# Altium schematic sheet PMIC.SchDoc
size A4; SheetNumber: 3; SheetTotal: 10
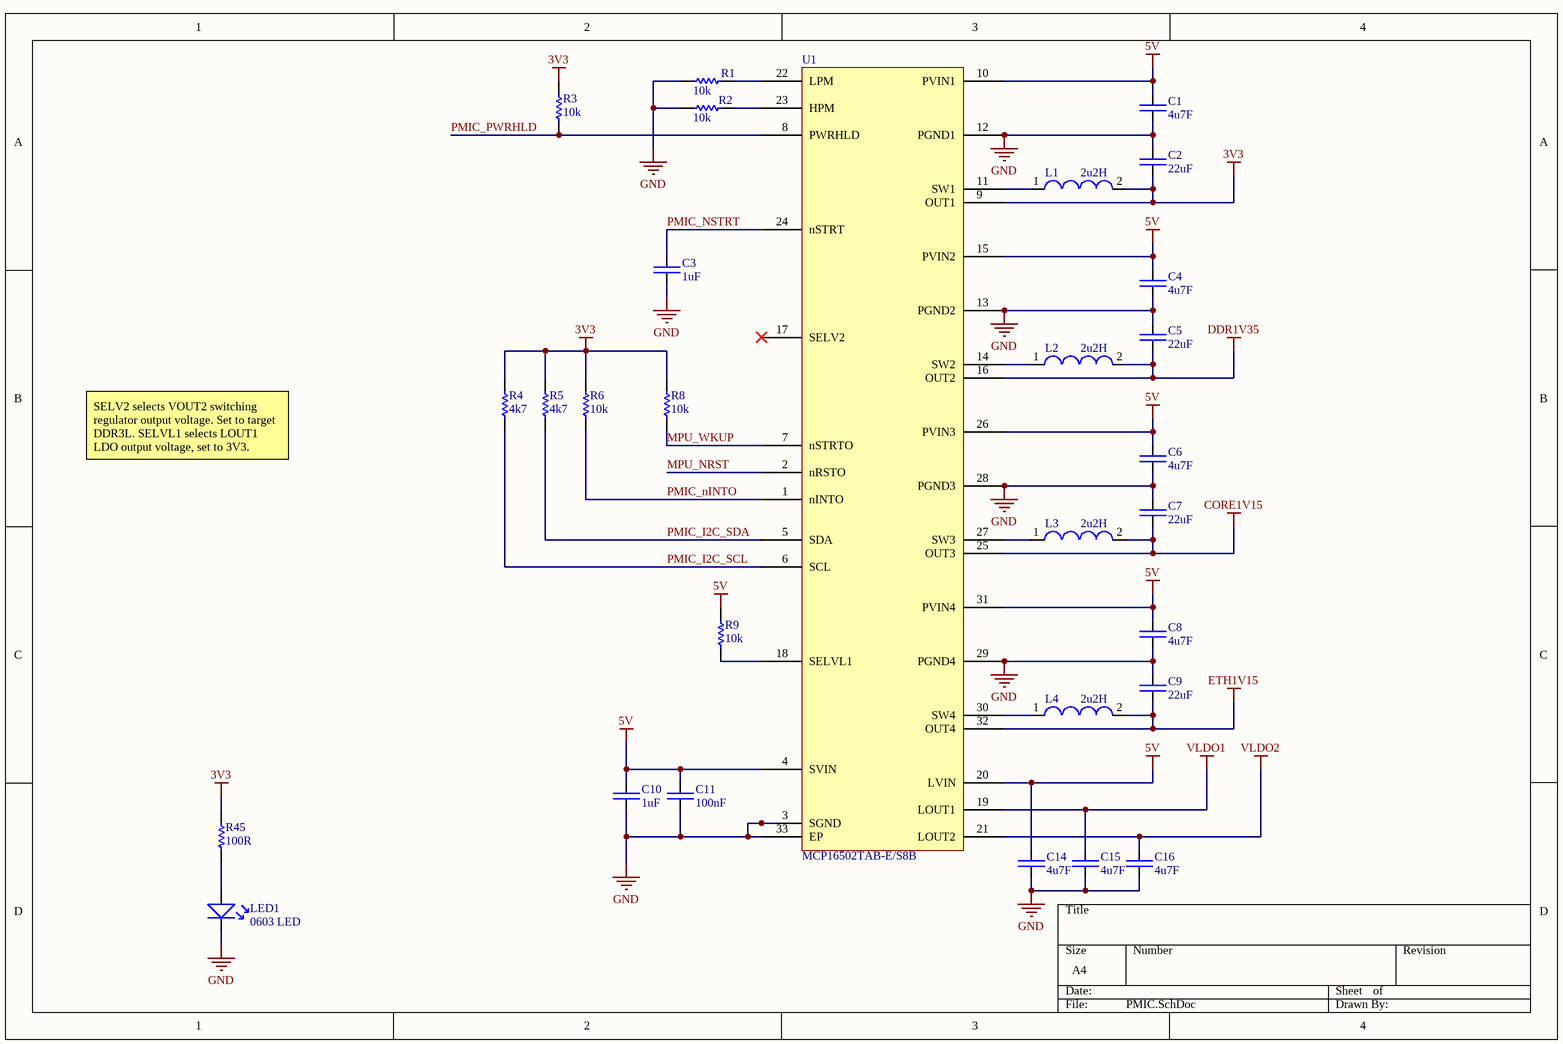
[diagram p0: PMIC.SchDoc]

## Parts
C1  4u7F  [CAP-0805]
C2  22uF  [CAP-1206]
C3  1uF  [CAP-0805]
C4  4u7F  [CAP-0805]
C5  22uF  [CAP-1206]
C6  4u7F  [CAP-0805]
C7  22uF  [CAP-1206]
C8  4u7F  [CAP-0805]
C9  22uF  [CAP-1206]
C10  1uF  [CAP-0805]
C11  100nF  [CAP-0603]
C14  4u7F  [CAP-0805]
C15  4u7F  [CAP-0805]
C16  4u7F  [CAP-0805]
L1  2u2H  [IND-1210]
L2  2u2H  [IND-1210]
L3  2u2H  [IND-1210]
L4  2u2H  [IND-1210]
LED1  0603 LED  [0603 LED]
R1  10k  [RES-0603]
R2  10k  [RES-0603]
R3  10k  [RES-0603]
R4  4k7  [RES-0603]
R5  4k7  [RES-0603]
R6  10k  [RES-0603]
R8  10k  [RES-0603]
R9  10k  [RES-0603]
R45  100R  [RES-0603]
U1  MCP16502TAB-E/S8B  [MCP16502TAB-E/S8B]

## Nets
3V3: C2.1 L1.2 R3.1 R4.2 R5.2 R6.2 R8.2 R45.2 U1.9(OUT1)
5V: C1.2 C4.2 C6.2 C8.2 C10.2 C11.2 C14.2 R9.2 U1.4(SVIN) U1.10(PVIN1) U1.15(PVIN2) U1.20(LVIN) U1.26(PVIN3) U1.31(PVIN4)
CORE1V15: C7.1 L3.2 U1.25(OUT3)
DDR1V35: C5.1 L2.2 U1.16(OUT2)
ETH1V15: C9.1 L4.2 U1.32(OUT4)
GND: C1.1 C2.2 C3.1 C4.1 C5.2 C6.1 C7.2 C8.1 C9.2 C10.1 C11.1 C14.1 C15.1 C16.1 LED1.2 R1.2 R2.2 U1.3(SGND) U1.12(PGND1) U1.13(PGND2) U1.28(PGND3) U1.29(PGND4) U1.33(EP)
VLDO1: C15.2 U1.19(LOUT1)
VLDO2: C16.2 U1.21(LOUT2)
MPU_NRST: U1.2(nRSTO)
MPU_WKUP: R8.1 U1.7(nSTRTO)
PMIC_I2C_SCL: R4.1 U1.6(SCL)
PMIC_I2C_SDA: R5.1 U1.5(SDA)
PMIC_nINTO: R6.1 U1.1(nINTO)
PMIC_NSTRT: C3.2 U1.24(nSTRT)
PMIC_PWRHLD: R3.2 U1.8(PWRHLD)
NetL1_1: L1.1 U1.11(SW1)
NetL2_1: L2.1 U1.14(SW2)
NetL3_1: L3.1 U1.27(SW3)
NetL4_1: L4.1 U1.30(SW4)
NetLED1_1: LED1.1 R45.1
NetR1_1: R1.1 U1.22(LPM)
NetR2_1: R2.1 U1.23(HPM)
NetR9_1: R9.1 U1.18(SELVL1)

Not connected (* = marked no-connect by the designer): U1 17(SELV2)*

## Notes on the sheet
- SELV2 selects VOUT2 switching regulator output voltage. Set to target DDR3L. SELVL1 selects LOUT1 LDO output voltage, set to 3V3.

## Library data of the parts
C1 C3 C4 C6 C8 C10 C14-C16 = CAP-0805: Capacitor chip unpolarized. 0805
C2 C5 C7 C9 = CAP-1206: Capacitor chip unpolarized. 1206
C11 = CAP-0603: Capacitor chip unpolarized. 0603
L1-L4 = IND-1210
R1-R6 R8 R9 R45 = RES-0603: Resistor chip. 0603
U1 = MCP16502TAB-E/S8B: Microchip PMIC for SAM9X devices